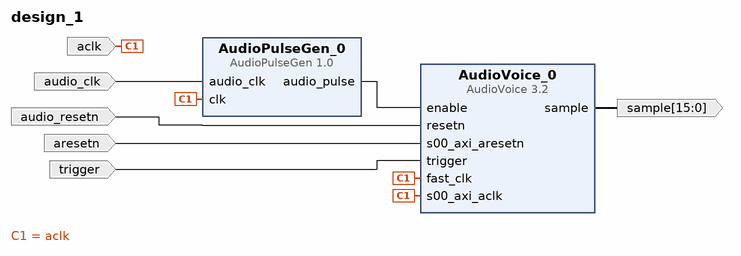
[diagram p0: block diagram of the top level]
# Vivado block design design_1, xc7a200tsbg484-1, Vivado 2018.3.1
create_bd_design design_1

create_bd_port -dir I -type clk aclk
set_property -dict {CONFIG.ASSOCIATED_RESET aresetn} [get_bd_ports aclk]
create_bd_port -dir I -type clk audio_clk
create_bd_port -dir I -type rst audio_resetn
create_bd_port -dir I -type rst aresetn
create_bd_port -dir I trigger
create_bd_port -dir O -from 15 -to 0 sample

create_bd_cell -type ip -vlnv utoronto.ca:user:AudioVoice:3.2 AudioVoice_0
set_property -dict {CONFIG.C_PITCH_DEFAULT 0x000A} [get_bd_cells AudioVoice_0]
create_bd_cell -type ip -vlnv utoronto.ca:user:AudioPulseGen:1.0 AudioPulseGen_0

# ---- connections ----

connect_bd_net -net clk_0_1 [get_bd_ports aclk] \
  [get_bd_pins AudioPulseGen_0/clk] [get_bd_pins AudioVoice_0/s00_axi_aclk] [get_bd_pins AudioVoice_0/fast_clk]
connect_bd_net -net audio_clk_0_1 [get_bd_ports audio_clk] [get_bd_pins AudioPulseGen_0/audio_clk]
connect_bd_net -net resetn_0_1 [get_bd_ports audio_resetn] [get_bd_pins AudioVoice_0/resetn]
connect_bd_net -net s00_axi_aresetn_0_1 [get_bd_ports aresetn] [get_bd_pins AudioVoice_0/s00_axi_aresetn]
connect_bd_net -net trigger_0_1 [get_bd_ports trigger] [get_bd_pins AudioVoice_0/trigger]
connect_bd_net [get_bd_pins AudioVoice_0/sample] [get_bd_ports sample]
connect_bd_net [get_bd_pins AudioPulseGen_0/audio_pulse] [get_bd_pins AudioVoice_0/enable]

validate_bd_design
save_bd_design
